# Altium schematic sheet [11] - CPU - POWER.SchDoc
size A2; DocumentNumber: 11; SheetNumber: 11; SheetTotal: 20
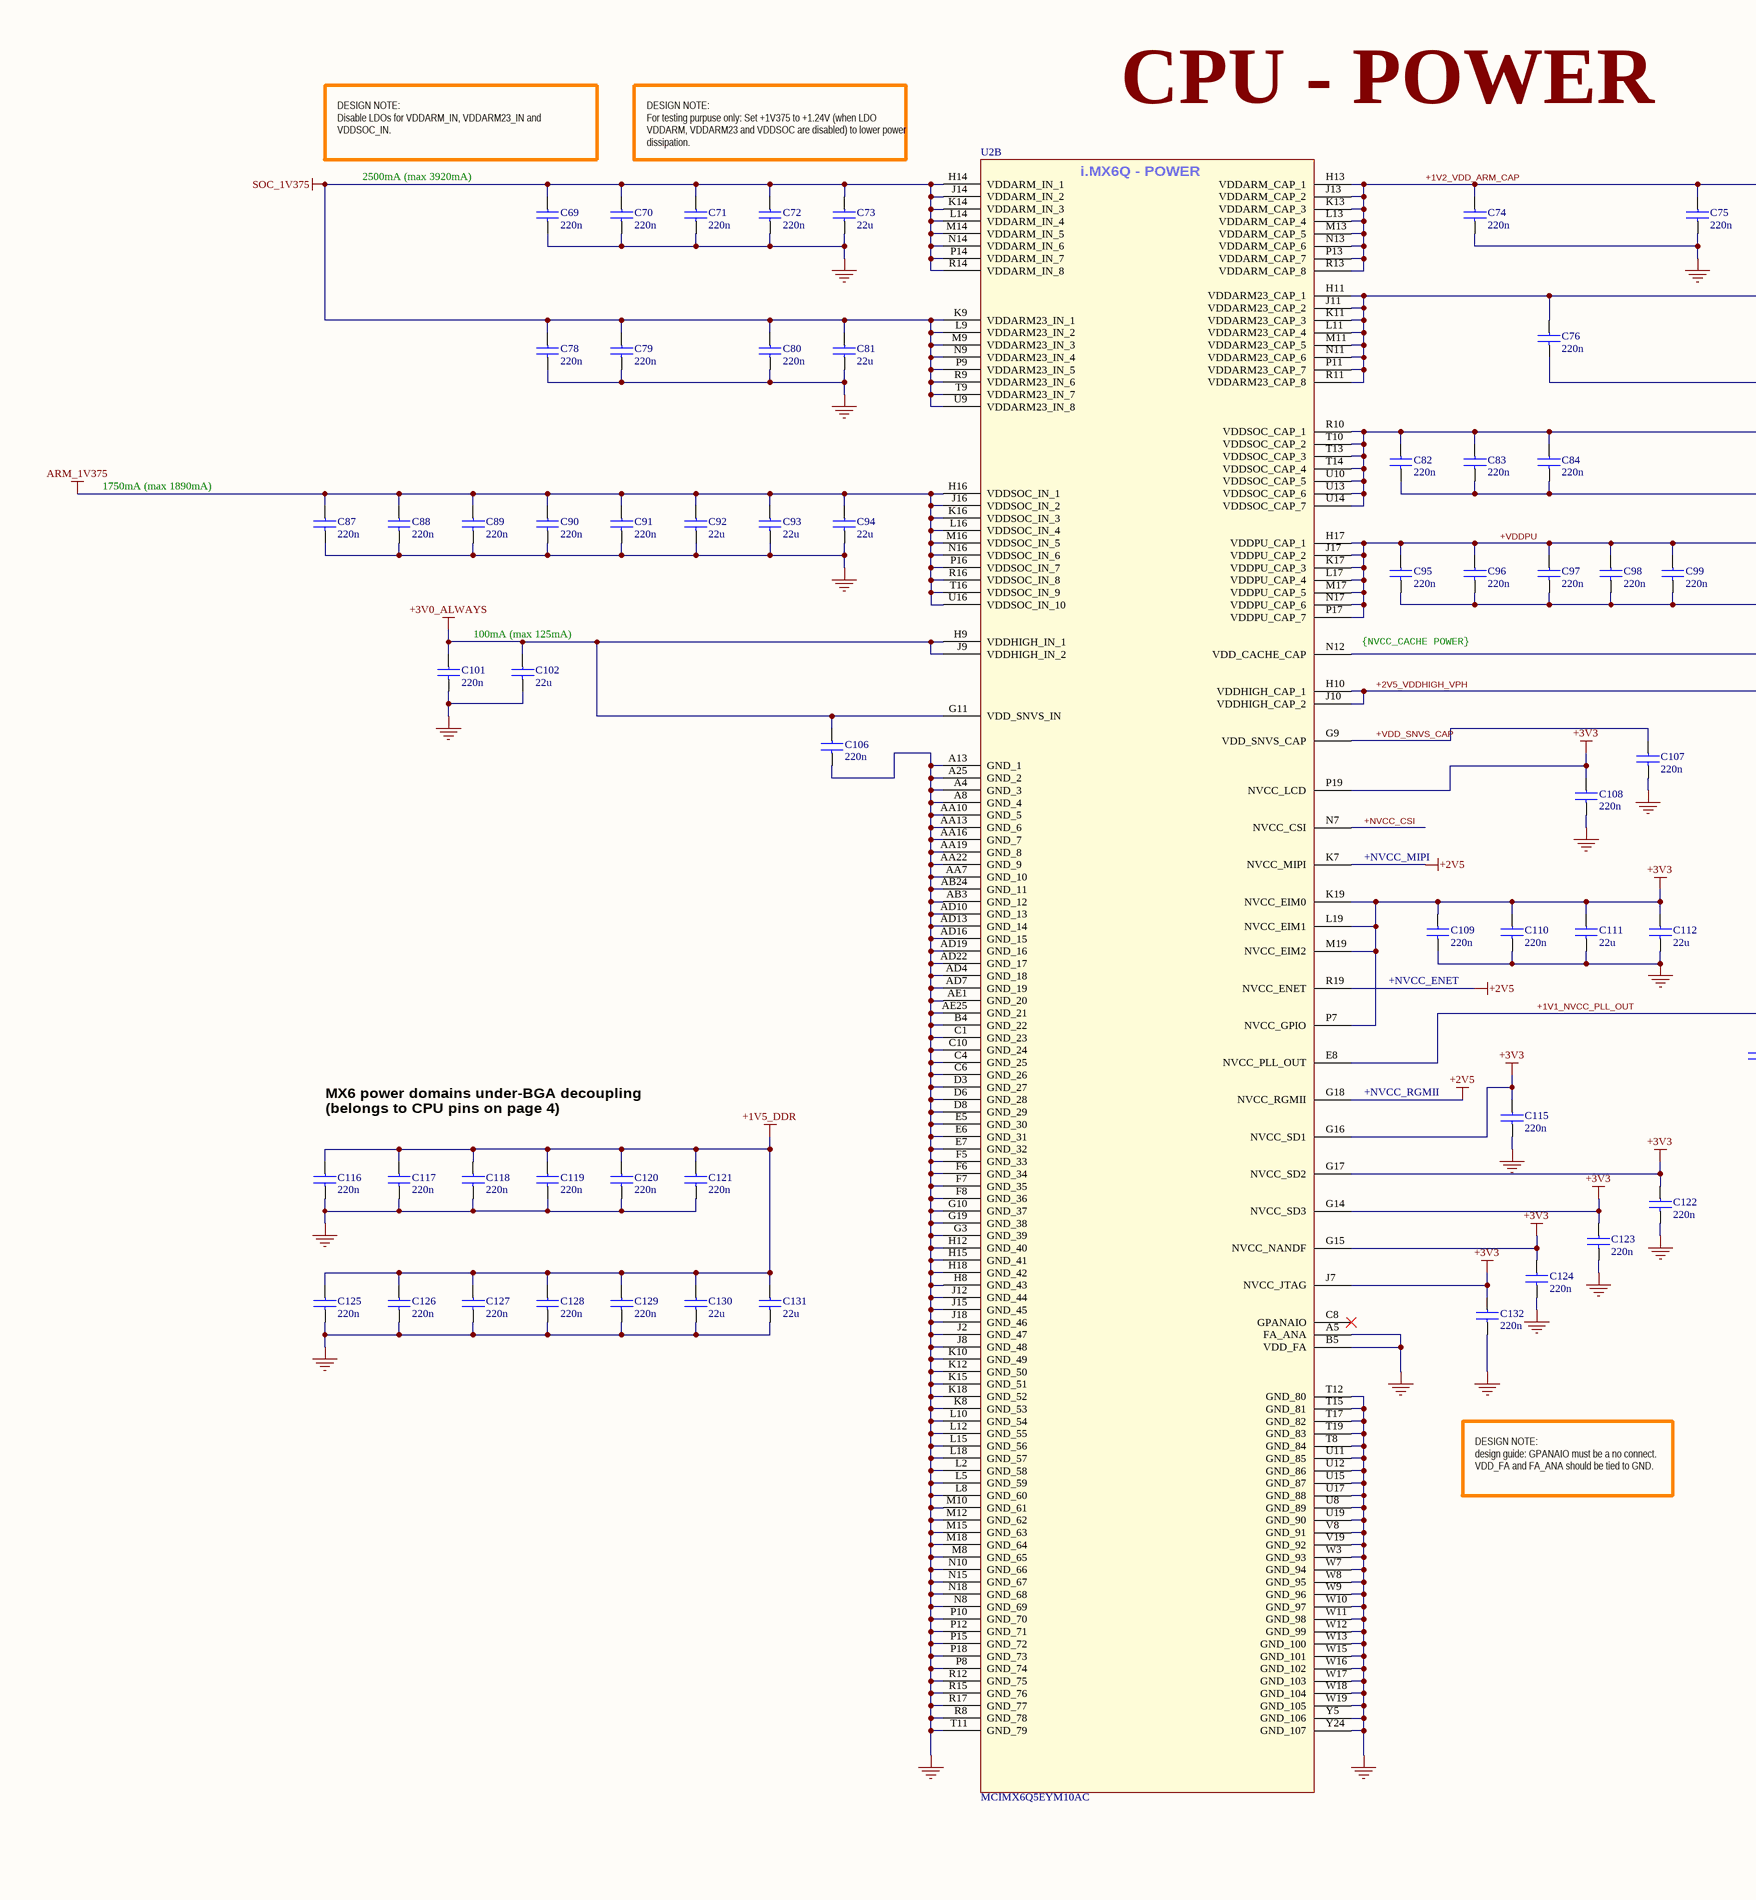
[diagram p0: [11] - CPU - POWER.SchDoc, left]
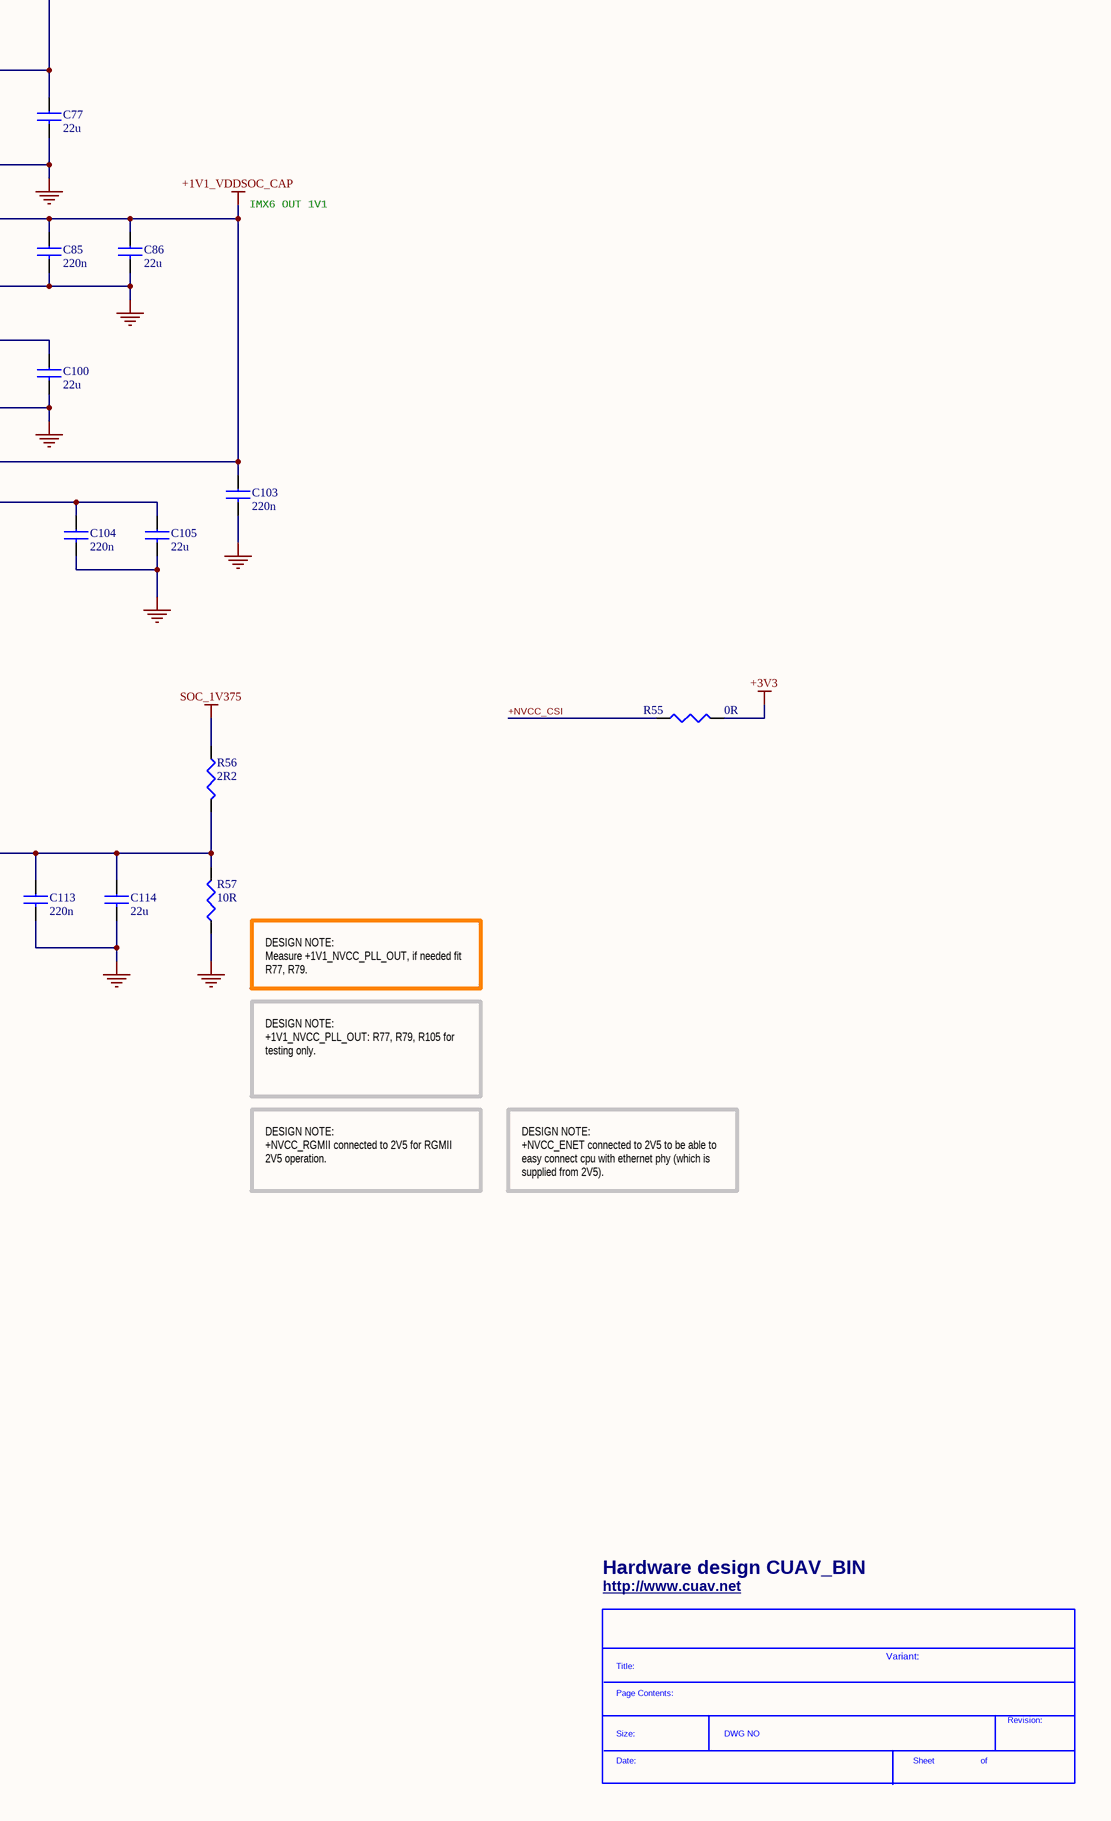
[diagram p1: [11] - CPU - POWER.SchDoc, right]

## Parts
*  SDTitleBlock  (value not drawn)  (graphical)
C69  220n  [0402cap]
C70  220n  [0402cap]
C71  220n  [0402cap]
C72  220n  [0402cap]
C73  22u  [C0603]
C74  220n  [0402cap]
C75  220n  [0402cap]
C76  220n  [0402cap]
C77  22u  [C0603]
C78  220n  [0402cap]
C79  220n  [0402cap]
C80  220n  [0402cap]
C81  22u  [C0603]
C82  220n  [0402cap]
C83  220n  [0402cap]
C84  220n  [0402cap]
C85  220n  [0402cap]
C86  22u  [C0603]
C87  220n  [0402cap]
C88  220n  [0402cap]
C89  220n  [0402cap]
C90  220n  [0402cap]
C91  220n  [0402cap]
C92  22u  [C0603]
C93  22u  [C0603]
C94  22u  [C0603]
C95  220n  [0402cap]
C96  220n  [0402cap]
C97  220n  [0402cap]
C98  220n  [0402cap]
C99  220n  [0402cap]
C100  22u  [C0603]
C101  220n  [0402cap]
C102  22u  [C0805]
C103  220n  [0402cap]
C104  220n  [0402cap]
C105  22u  [0805cap]
C106  220n  [0402cap]
C107  220n  [0402cap]
C108  220n  [0402cap]
C109  220n  [0402cap]
C110  220n  [0402cap]
C111  22u  [0805cap]
C112  22u  [0805cap]
C113  220n  [C0402]
C114  22u  [C0603]
C115  220n  [0402cap]
C116  220n  [0402cap]
C117  220n  [0402cap]
C118  220n  [0402cap]
C119  220n  [0402cap]
C120  220n  [0402cap]
C121  220n  [0402cap]
C122  220n  [0402cap]
C123  220n  [0402cap]
C124  220n  [0402cap]
C125  220n  [0402cap]
C126  220n  [0402cap]
C127  220n  [0402cap]
C128  220n  [0402cap]
C129  220n  [0402cap]
C130  22u  [C0603]
C131  22u  [C0603]
C132  220n  [0402cap]
R55  0R  [R0402]
R56  2R2  [R0402]
R57  10R  [R0402]
U2  MCIMX6Q5EYM10AC  [PBGA624]  (part B of 15)

## Nets
+1V1_VDDSOC_CAP: C82.1 C83.1 C84.1 C85.1 C86.1 C103.1 U2.N12(VDD_CACHE_CAP) U2.R10(VDDSOC_CAP_1) U2.T10(VDDSOC_CAP_2) U2.T13(VDDSOC_CAP_3) U2.T14(VDDSOC_CAP_4) U2.U10(VDDSOC_CAP_5) U2.U13(VDDSOC_CAP_6) U2.U14(VDDSOC_CAP_7)
+1V5_DDR: C116.1 C117.1 C118.1 C119.1 C120.1 C121.1 C125.1 C126.1 C127.1 C128.1 C129.1 C130.1 C131.1
+2V5: U2.G18(NVCC_RGMII) U2.K7(NVCC_MIPI) U2.R19(NVCC_ENET)
+3V0_ALWAYS: C101.1 C102.1 C106.1 U2.G11(VDD_SNVS_IN) U2.H9(VDDHIGH_IN_1) U2.J9(VDDHIGH_IN_2)
+3V3: C108.1 C109.1 C110.1 C111.1 C112.1 C115.1 C122.1 C123.1 C124.1 C132.1 R55.2 U2.G14(NVCC_SD3) U2.G15(NVCC_NANDF) U2.G16(NVCC_SD1) U2.G17(NVCC_SD2) U2.J7(NVCC_JTAG) U2.K19(NVCC_EIM0) U2.L19(NVCC_EIM1) U2.M19(NVCC_EIM2) U2.P7(NVCC_GPIO) U2.P19(NVCC_LCD)
ARM_1V375: C87.1 C88.1 C89.1 C90.1 C91.1 C92.1 C93.1 C94.1 U2.H16(VDDSOC_IN_1) U2.J16(VDDSOC_IN_2) U2.K16(VDDSOC_IN_3) U2.L16(VDDSOC_IN_4) U2.M16(VDDSOC_IN_5) U2.N16(VDDSOC_IN_6) U2.P16(VDDSOC_IN_7) U2.R16(VDDSOC_IN_8) U2.T16(VDDSOC_IN_9) U2.U16(VDDSOC_IN_10)
GND: C69.2 C70.2 C71.2 C72.2 C73.2 C74.2 C75.2 C76.2 C77.2 C78.2 C79.2 C80.2 C81.2 C82.2 C83.2 C84.2 C85.2 C86.2 C87.2 C88.2 C89.2 C90.2 C91.2 C92.2 C93.2 C94.2 C95.2 C96.2 C97.2 C98.2 C99.2 C100.2 C101.2 C102.2 C103.2 C104.2 C105.2 C106.2 C107.2 C108.2 C109.2 C110.2 C111.2 C112.2 C113.2 C114.2 C115.2 C116.2 C117.2 C118.2 C119.2 C120.2 C121.2 C122.2 C123.2 C124.2 C125.2 C126.2 C127.2 C128.2 C129.2 C130.2 C131.2 C132.2 R57.1 U2.A4(GND_3) U2.A5(FA_ANA) U2.A8(GND_4) U2.A13(GND_1) U2.A25(GND_2) U2.AA7(GND_10) U2.AA10(GND_5) U2.AA13(GND_6) U2.AA16(GND_7) U2.AA19(GND_8) U2.AA22(GND_9) U2.AB3(GND_12) U2.AB24(GND_11) U2.AD4(GND_18) U2.AD7(GND_19) U2.AD10(GND_13) U2.AD13(GND_14) U2.AD16(GND_15) U2.AD19(GND_16) U2.AD22(GND_17) U2.AE1(GND_20) U2.AE25(GND_21) U2.B4(GND_22) U2.B5(VDD_FA) U2.C1(GND_23) U2.C4(GND_25) U2.C6(GND_26) U2.C10(GND_24) U2.D3(GND_27) U2.D6(GND_28) U2.D8(GND_29) U2.E5(GND_30) U2.E6(GND_31) U2.E7(GND_32) U2.F5(GND_33) U2.F6(GND_34) U2.F7(GND_35) U2.F8(GND_36) U2.G3(GND_39) U2.G10(GND_37) U2.G19(GND_38) U2.H8(GND_43) U2.H12(GND_40) U2.H15(GND_41) U2.H18(GND_42) U2.J2(GND_47) U2.J8(GND_48) U2.J12(GND_44) U2.J15(GND_45) U2.J18(GND_46) U2.K8(GND_53) U2.K10(GND_49) U2.K12(GND_50) U2.K15(GND_51) U2.K18(GND_52) U2.L2(GND_58) U2.L5(GND_59) U2.L8(GND_60) U2.L10(GND_54) U2.L12(GND_55) U2.L15(GND_56) U2.L18(GND_57) U2.M8(GND_65) U2.M10(GND_61) U2.M12(GND_62) U2.M15(GND_63) U2.M18(GND_64) U2.N8(GND_69) U2.N10(GND_66) U2.N15(GND_67) U2.N18(GND_68) U2.P8(GND_74) U2.P10(GND_70) U2.P12(GND_71) U2.P15(GND_72) U2.P18(GND_73) U2.R8(GND_78) U2.R12(GND_75) U2.R15(GND_76) U2.R17(GND_77) U2.T8(GND_84) U2.T11(GND_79) U2.T12(GND_80) U2.T15(GND_81) U2.T17(GND_82) U2.T19(GND_83) U2.U8(GND_89) U2.U11(GND_85) U2.U12(GND_86) U2.U15(GND_87) U2.U17(GND_88) U2.U19(GND_90) U2.V8(GND_91) U2.V19(GND_92) U2.W3(GND_93) U2.W7(GND_94) U2.W8(GND_95) U2.W9(GND_96) U2.W10(GND_97) U2.W11(GND_98) U2.W12(GND_99) U2.W13(GND_100) U2.W15(GND_101) U2.W16(GND_102) U2.W17(GND_103) U2.W18(GND_104) U2.W19(GND_105) U2.Y5(GND_106) U2.Y24(GND_107)
SOC_1V375: C69.1 C70.1 C71.1 C72.1 C73.1 C78.1 C79.1 C80.1 C81.1 R56.1 U2.H14(VDDARM_IN_1) U2.J14(VDDARM_IN_2) U2.K9(VDDARM23_IN_1) U2.K14(VDDARM_IN_3) U2.L9(VDDARM23_IN_2) U2.L14(VDDARM_IN_4) U2.M9(VDDARM23_IN_3) U2.M14(VDDARM_IN_5) U2.N9(VDDARM23_IN_4) U2.N14(VDDARM_IN_6) U2.P9(VDDARM23_IN_5) U2.P14(VDDARM_IN_7) U2.R9(VDDARM23_IN_6) U2.R14(VDDARM_IN_8) U2.T9(VDDARM23_IN_7) U2.U9(VDDARM23_IN_8)
+1V1_NVCC_PLL_OUT: C113.1 C114.1 R56.2 R57.2 U2.E8(NVCC_PLL_OUT)
+1V2_VDD_ARM_CAP: C74.1 C75.1 C76.1 C77.1 U2.H11(VDDARM23_CAP_1) U2.H13(VDDARM_CAP_1) U2.J11(VDDARM23_CAP_2) U2.J13(VDDARM_CAP_2) U2.K11(VDDARM23_CAP_3) U2.K13(VDDARM_CAP_3) U2.L11(VDDARM23_CAP_4) U2.L13(VDDARM_CAP_4) U2.M11(VDDARM23_CAP_5) U2.M13(VDDARM_CAP_5) U2.N11(VDDARM23_CAP_6) U2.N13(VDDARM_CAP_6) U2.P11(VDDARM23_CAP_7) U2.P13(VDDARM_CAP_7) U2.R11(VDDARM23_CAP_8) U2.R13(VDDARM_CAP_8)
+2V5_VDDHIGH_VPH: C104.1 C105.1 U2.H10(VDDHIGH_CAP_1) U2.J10(VDDHIGH_CAP_2)
+NVCC_CSI: R55.1 U2.N7(NVCC_CSI)
+VDD_SNVS_CAP: C107.1 U2.G9(VDD_SNVS_CAP)
+VDDPU: C95.1 C96.1 C97.1 C98.1 C99.1 C100.1 U2.H17(VDDPU_CAP_1) U2.J17(VDDPU_CAP_2) U2.K17(VDDPU_CAP_3) U2.L17(VDDPU_CAP_4) U2.M17(VDDPU_CAP_5) U2.N17(VDDPU_CAP_6) U2.P17(VDDPU_CAP_7)

Not connected (* = marked no-connect by the designer): U2 C8(GPANAIO)*

## Notes on the sheet
- CPU - POWER
- DESIGN NOTE:
  Disable LDOs for VDDARM_IN, VDDARM23_IN and VDDSOC_IN.
- 2500mA (max 3920mA)
- DESIGN NOTE:
  For testing purpuse only: Set +1V375 to +1.24V (when LDO VDDARM, VDDARM23 and VDDSOC are disabled) to lower power dissipation.
- IMX6 OUT 1V1
- 1750mA (max 1890mA)
- 100mA (max 125mA)
- {NVCC_CACHE POWER}
- +NVCC_MIPI
- (near C109) +NVCC_ENET
- +NVCC_RGMII
- MX6 power domains under-BGA decoupling (belongs to CPU pins on page 4)
- DESIGN NOTE:
  Measure +1V1_NVCC_PLL_OUT, if needed fit R77, R79.
- DESIGN NOTE:
  +1V1_NVCC_PLL_OUT: R77, R79, R105 for testing only.
- DESIGN NOTE:
  +NVCC_RGMII connected to 2V5 for RGMII 2V5 operation.
- DESIGN NOTE:
  +NVCC_ENET connected to 2V5 to be able to easy connect cpu with ethernet phy (which is supplied from 2V5).
- DESIGN NOTE:
  design guide: GPANAIO must be a no connect. VDD_FA and FA_ANA should be tied to GND.
- (near *) Hardware design CUAV_BIN
- (near *) http://www.cuav.net
- Variant:
- (in symbol MCIMX6Q5EYM10AC, part B) i.MX6Q - POWER
- (in symbol SDTitleBlock) Title:; Page Contents:; Revision:; Size:; DWG NO; Date:; Sheet; of

## Library data of the parts
C69-C72 C74-C76 C78-C80 C82-C85 C87-C91 C95-C99 C101 C103 C104 C106-C110 C113 C115-C129 C132 = C1005X5R1E224M: CAP CER .22UF 25V X5R 20% 0402; Manufacturer: TDK Corporation; Capacitance: 0.22礔; Value: 220nF; .Checked PCB: used; Tolerance: ?0%; Category: Capacitors; Supplier Part Number: 445-5945-1-ND; Manufacturer Part Number: C1005X5R1E224M; Operating Temperature: -55癈 ~ 85癈; Package / Case: 0402 (1005 Metric); Price 1k [$]: 0.02600; .Checked SCH: used; Voltage - Rated: 25V; Supplier: Digikey; Supplier 1: Digi-Key; Supplier Part Number 1: 445-5945-1-ND; RoHS: RoHS Compliant; Stock 1: 54593; Pricing 1: 1=0.3, 10=0.2, 100=0.08, 250=0.05752, 500=0.041, 1000=0.03 (USD); Temperature Coefficient: X5R; Mounting Type: Surface Mount, MLCC; Applications: General Purpose; Ratings: -; Size / Dimension: 0.039" L x 0.020" W (1.00mm x 0.50mm); Height - Seated (Max): -; Thickness (Max): 0.022" (0.55mm); Lead Spacing: -; Features: -; Packaging: Cut Tape (CT); Lead Style: -; ComponentLink1URL: http://www.tdk.co.jp/tefe02/e412_c.pdf; ComponentLink1Description: http://www.tdk.co.jp/tefe02/e412_c.pdf
C73 C77 C81 C86 C92-C94 C100 C114 C130 C131 = GRM188R60G226MEA0L: CAP CER 22UF 4V 20% X5R 0603; Manufacturer: Murata Electronics North America; Capacitance: 22礔; Tolerance: ?0%; .Checked PCB: RF, used by MM; .Checked SCH: MM, checked by RF; .Creator: MM; Supplier 1: Digi-Key; Supplier Part Number 1: 490-5526-1-ND; Manufacturer Part Number: GRM188R60G226MEA0L; RoHS: RoHS Compliant; Category: Capacitors; Stock 1: 5760; Pricing 1: 1=0.79, 10=0.663, 50=0.4752, 100=0.4158, 250=0.32672, 500=0.297, 1000=0.2376 (USD); Voltage - Rated: 4V; Temperature Coefficient: X5R; Mounting Type: Surface Mount, MLCC; Operating Temperature: -55癈 ~ 85癈; Applications: General Purpose; Ratings: -; Package / Case: 0603 (1608 Metric); Size / Dimension: 0.063" L x 0.031" W (1.60mm x 0.80mm); Height - Seated (Max): -; Thickness (Max): 0.035" (0.90mm); Lead Spacing: -; Features: -; Packaging: Cut Tape (CT); Lead Style: -; ComponentLink1URL: http://www.murata.com/products/catalog/pdf/c02e.pdf; ComponentLink1Description: http://www.murata.com/products/catalog/pdf/c02e.pdf
C102 C105 C111 C112 = C2012X5R1C226K: CAP CER 22UF 16V 10% X5R 0805; Manufacturer: TDK Corporation; Capacitance: 22礔; Tolerance: ?0%; .Checked PCB: RF; Supplier 1: Digi-Key; Supplier Part Number 1: 445-6797-1-ND; Manufacturer Part Number: C2012X5R1C226K; RoHS: RoHS Compliant; Category: Capacitors; Stock 1: 15408; Pricing 1: 1=0.77, 10=0.737, 100=0.3575, 250=0.297, 500=0.2695, 1000=0.2475 (USD); Voltage - Rated: 16V; Temperature Coefficient: X5R; Mounting Type: Surface Mount, MLCC; Operating Temperature: -55癈 ~ 85癈; Applications: General Purpose; Ratings: -; Package / Case: 0805 (2012 Metric); Size / Dimension: 0.079" L x 0.049" W (2.00mm x 1.25mm); Height - Seated (Max): -; Thickness (Max): 0.057" (1.45mm); Lead Spacing: -; Features: -; Packaging: Cut Tape (CT); Lead Style: -; ComponentLink1URL: http://www.tdk.com/pdf/general_B11.pdf; ComponentLink1Description: http://www.tdk.com/pdf/general_B11.pdf; .Checked SCH: RF
R55 = RC0402JR-070RL: RES 0.0 OHM 1/16W 0402 SMD; Manufacturer: Yageo; Resistance (Ohms): 0.0; Power (Watts): 0.063W, 1/16W; Tolerance: Jumper; .Checked PCB: used; Category: Resistors; Supplier Part Number: 311-0.0JRCT-ND; Manufacturer Part Number: RC0402JR-070RL; Package / Case: 0402 (1005 Metric); Price 1k [$]: 0.01389; Value: 0R; .Checked SCH: used; Supplier: Digikey; Supplier 1: Digi-Key; Supplier Part Number 1: 311-0.0JRCT-ND; RoHS: RoHS Compliant; Stock 1: 1106330; Pricing 1: 10=0.012, 50=0.009, 100=0.0069, 250=0.00512, 500=0.0038, 1000=0.00253 (USD); Composition: Thick Film; Features: -; Temperature Coefficient: -; Size / Dimension: 0.039" L x 0.020" W (1.00mm x 0.50mm); Height: 0.016" (0.40mm); Number of Terminations: 2; Packaging: Cut Tape (CT); ComponentLink1URL: http://www.yageo.com/documents/recent/PYu-RC0402_51_RoHS_L_6.pdf; ComponentLink1Description: http://www.yageo.com/documents/recent/PYu-RC0402_51_RoHS_L_6.pdf
R56 = CRCW04022R20FKED: RES 2.20 OHM 1/16W 1% 0402 SMD; Manufacturer: Vishay Dale; Resistance (Ohms): 2.2; Power (Watts): 0.063W, 1/16W; Temperature Coefficient: ?00ppm/癈; Tolerance: ?%; .Checked PCB: RF; Supplier 1: Digi-Key; Supplier Part Number 1: 541-2.20LLCT-ND; Manufacturer Part Number: CRCW04022R20FKED; RoHS: RoHS Compliant; Category: Resistors; Stock 1: 10205; Pricing 1: 10=0.083, 50=0.0444, 200=0.0255, 1000=0.0174 (USD); Composition: Thick Film; Features: -; Package / Case: 0402 (1005 Metric); Size / Dimension: 0.039" L x 0.020" W (1.00mm x 0.50mm); Height: 0.016" (0.40mm); Number of Terminations: 2; Packaging: Cut Tape (CT); ComponentLink1URL: http://www.vishay.com/docs/20035/dcrcwe3.pdf; ComponentLink1Description: http://www.vishay.com/docs/20035/dcrcwe3.pdf; .Checked SCH: RF
R57 = RC0402FR-0710RL: RES 10.0 OHM 1/16W 1% 0402 SMD; Manufacturer: Yageo; Resistance (Ohms): 10; Power (Watts): 0.063W, 1/16W; Tolerance: ?%; .Checked PCB: used; Temperature Coefficient: ?00ppm/癈; Category: Resistors; Supplier Part Number: 311-10.0LRCT-ND; Manufacturer Part Number: RC0402FR-0710RL; Package / Case: 0402 (1005 Metric); Price 1k [$]: 0.01421; Value: 10R; .Checked SCH: used; Supplier: Digikey; Supplier 1: Digi-Key; Supplier Part Number 1: 311-10.0LRCT-ND; RoHS: RoHS Compliant; Stock 1: 681416; Pricing 1: 10=0.014, 50=0.0104, 100=0.0079, 250=0.00584, 500=0.00432, 1000=0.00288 (USD); Composition: Thick Film; Features: -; Size / Dimension: 0.039" L x 0.020" W (1.00mm x 0.50mm); Height: 0.016" (0.40mm); Number of Terminations: 2; Packaging: Cut Tape (CT); ComponentLink1URL: http://www.yageo.com/documents/recent/PYu-RC0402_51_RoHS_L_6.pdf; ComponentLink1Description: http://www.yageo.com/documents/recent/PYu-RC0402_51_RoHS_L_6.pdf
U2 = MCIMX6Q5EYM10AC: IC MCU 32BIT ARM QUAD 624FCBGA; Manufacturer: Freescale Semiconductor; Core Processor: ARM?Cortex?A9; Core Size: 32-Bit Quad-Core; Speed: 1.0GHz; Connectivity: CAN, EBI/EMI, ESAI, Ethernet, GPMI, I2C, MMC/SD, PCI, SATA, SPI, UART, USB, USB OTG; Peripherals: DMA, HDMI, I2S/SSI/AC97, MIPI CSI, MIMI DSI, MIPI HIS, PWM, WDT; Number of I /O: 224; Program Memory Type: External Program Memory; RAM Size: 256K x 8; Voltage - Supply (Vcc/Vdd): 0.925 V ~ 1.5 V; Oscillator Type: Internal; .Creator: MM; .Checked PCB: MM, checked by RF; Supplier 1: Digi-Key; Manufacturer Part Number: MCIMX6Q5EYM10AC; RoHS: RoHS Compliant; Category: Integrated Circuits (ICs); Stock 1: 0; Pricing 1: 1=54.98, 10=51.922, 25=48.868, 100=30.5424 (USD); Program Memory Size: -; EEPROM Size: -; Data Converters: -; Operating Temperature: -20癈 ~ 105癈; Package / Case: 624-FBGA, FCBGA; Packaging: Tray; ComponentLink1URL: http://cache.freescale.com/files/32bit/doc/data_sheet/IMX6DQCEC.pdf; ComponentLink1Description: http://cache.freescale.com/files/32bit/doc/data_sheet/IMX6DQCEC.pdf; Supplier Part Number 1: MCIMX6Q5EYM10AC-ND; .Checked SCH: MM